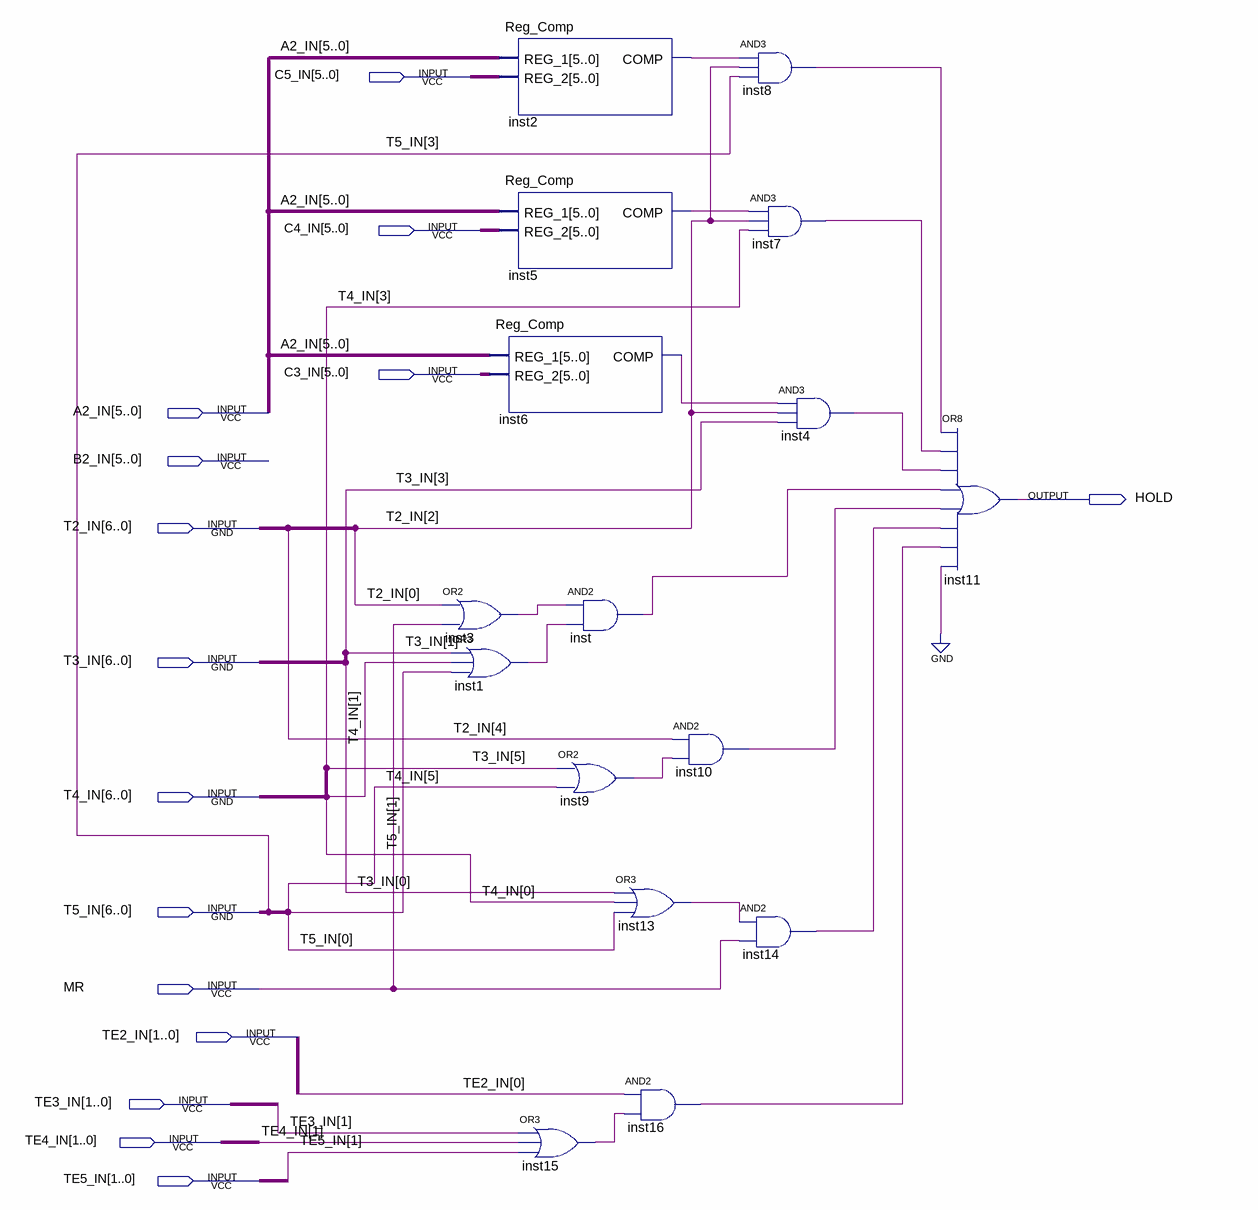
[diagram p0: schematic sheet]
// Quartus schematic UC-2.bdf as structural Verilog: 16 symbols, 15 pins
module \UC-2  (
  input  [5:0] C5_IN,
  input  [5:0] C4_IN,
  input  [5:0] C3_IN,
  input  [5:0] A2_IN,
  input  [5:0] B2_IN,
  input  [6:0] T2_IN,
  input  [6:0] T3_IN,
  input  [6:0] T4_IN,
  input  [6:0] T5_IN,
  input  MR,
  input  [1:0] TE2_IN,
  input  [1:0] TE3_IN,
  input  [1:0] TE4_IN,
  input  [1:0] TE5_IN,
  output HOLD
);

  wire inst1_out, inst2_comp, inst3_out, inst4_out, inst5_comp, inst6_comp, inst7_out, inst8_out, inst9_out,
       inst10_out, inst13_out, inst14_out, inst15_out, inst16_out, inst_out;

  or inst3 (inst3_out, T2_IN[0], MR);
  or inst1 (inst1_out, T3_IN[1], T4_IN[1], T5_IN[1]);
  Reg_Comp inst2 (.REG_1(A2_IN), .REG_2(C5_IN), .COMP(inst2_comp));
  Reg_Comp inst5 (.REG_1(A2_IN), .REG_2(C4_IN), .COMP(inst5_comp));
  Reg_Comp inst6 (.REG_1(A2_IN), .REG_2(C3_IN), .COMP(inst6_comp));
  or inst9 (inst9_out, T3_IN[5], T4_IN[5]);
  or inst15 (inst15_out, TE3_IN[1], TE4_IN[1], TE5_IN[1]);
  and inst (inst_out, inst3_out, inst1_out);
  or inst13 (inst13_out, T3_IN[0], T4_IN[0], T5_IN[0]);
  and inst16 (inst16_out, TE2_IN[0], inst15_out);
  and inst10 (inst10_out, T2_IN[4], inst9_out);
  and inst8 (inst8_out, inst2_comp, T2_IN[2], T5_IN[3]);
  and inst7 (inst7_out, inst5_comp, T2_IN[2], T4_IN[3]);
  and inst4 (inst4_out, inst6_comp, T2_IN[2], T3_IN[3]);
  and inst14 (inst14_out, inst13_out, MR);
  or inst11 (HOLD, inst8_out, inst7_out, inst4_out, inst_out, inst10_out, inst14_out, inst16_out, 1'b0);
endmodule
